# EAGLE design 609_motor (EAGLE 9.2.2)
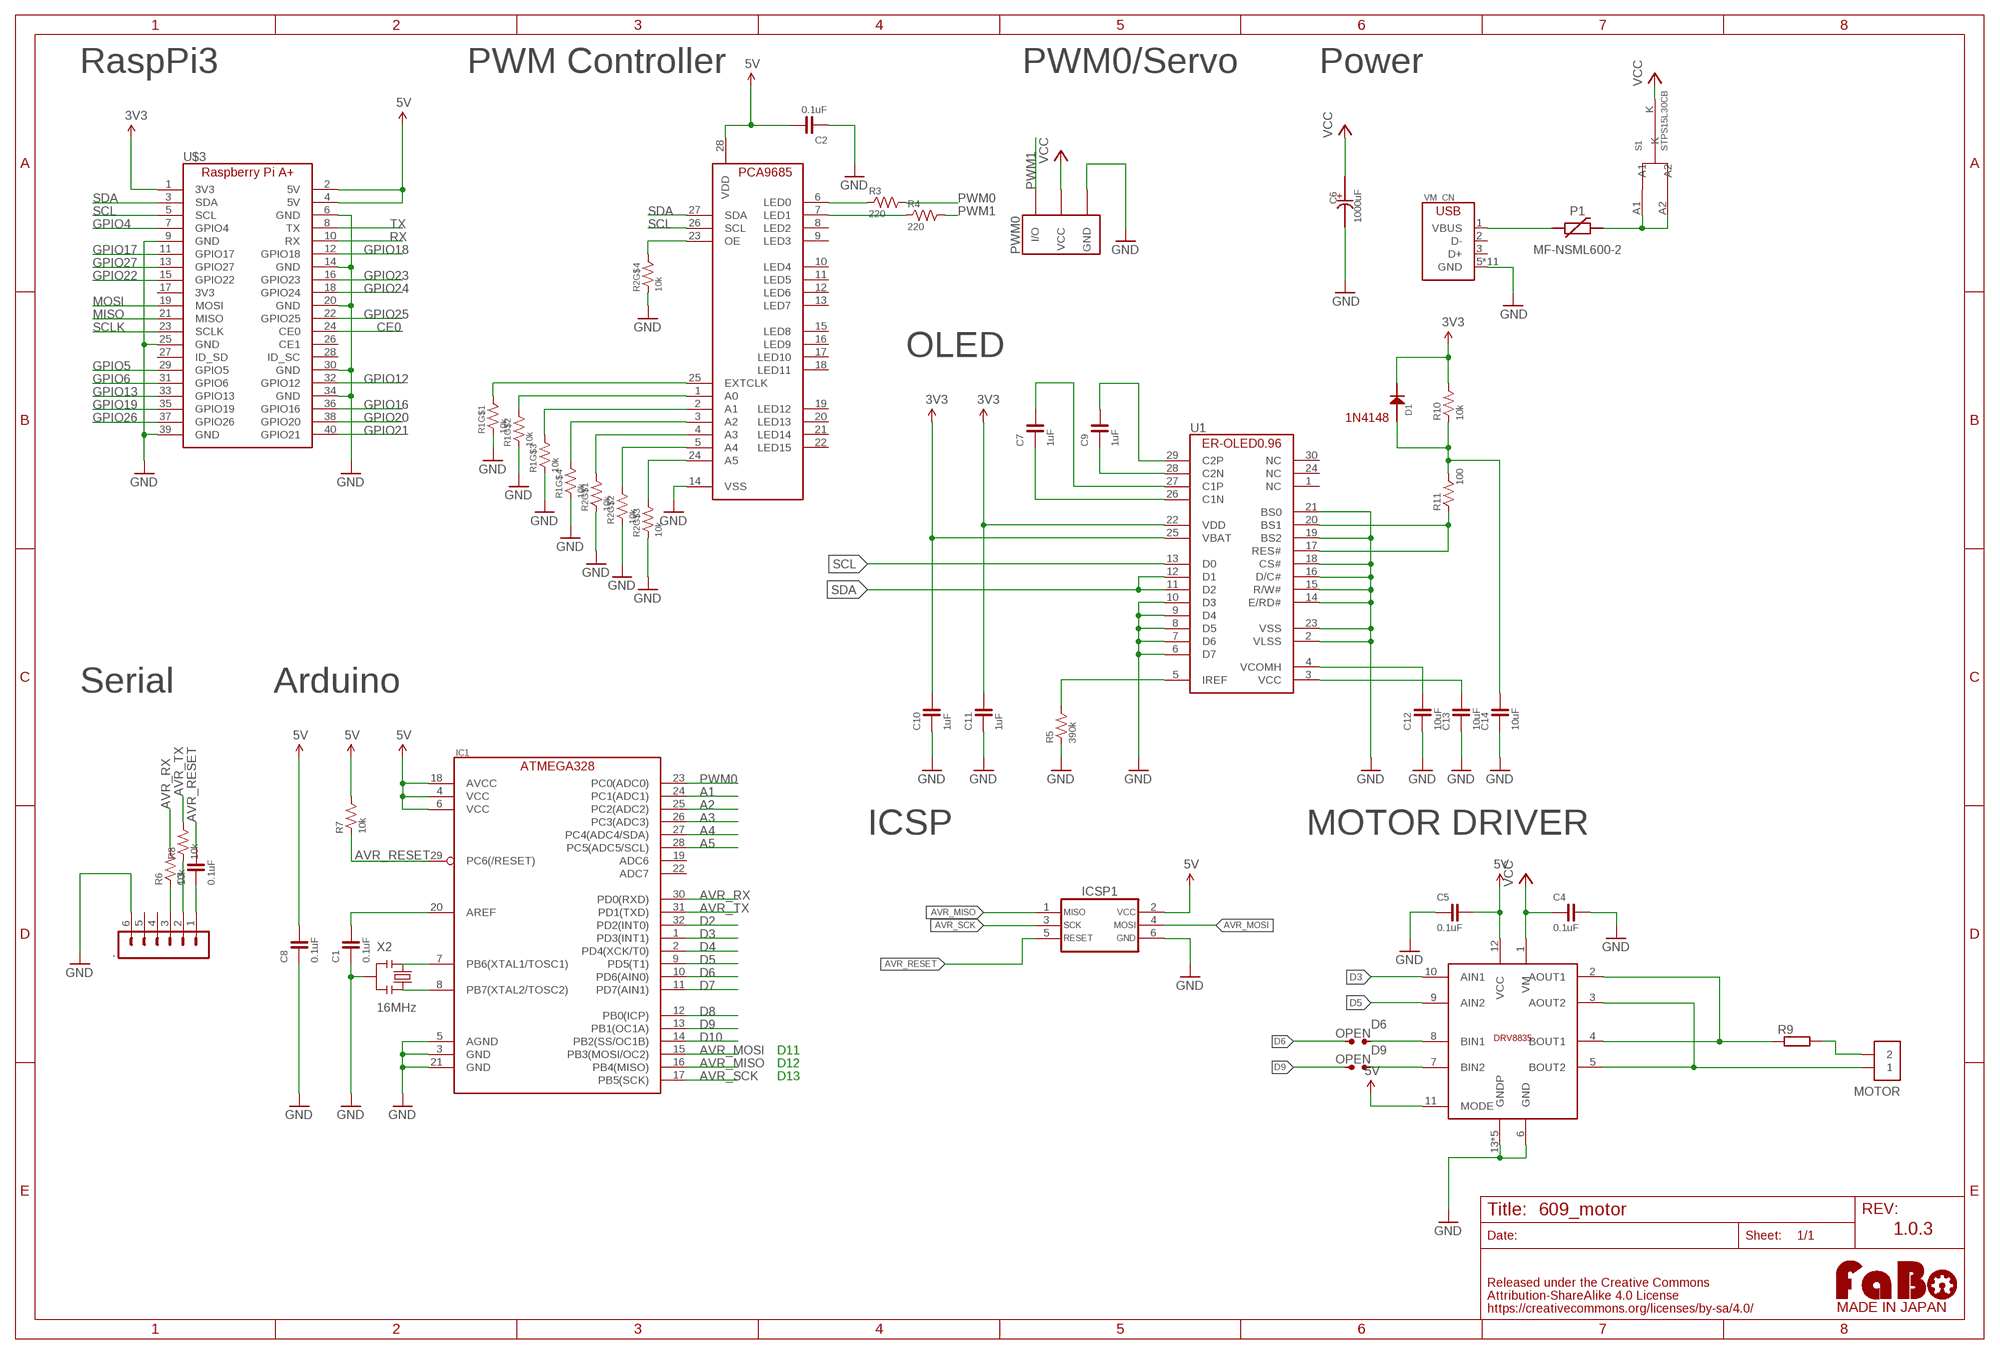
[diagram p0: schematic, sheet 1]

## Parts
.  MA06-1  [MA06-1]
C1  0.1uF  CAPACITOR-0603  [0603]
C2  0.1uF  CAPACITOR-0603  [0603]
C3  0.1uF  CAPACITOR-0603  [0603]
C4  0.1uF  CAPACITOR-0603  [0603]
C5  0.1uF  CAPACITOR-0603  [0603]
C6  1000uF  CAPACITOR-ALUMIN_D12_5  [D12.5]
C7  1uF  CAPACITOR-0603  [0603]
C8  0.1uF  CAPACITOR-0603  [0603]
C9  1uF  CAPACITOR-0603  [0603]
C10  1uF  CAPACITOR-0603  [0603]
C11  1uF  CAPACITOR-0603  [0603]
C12  10uF  CAPACITOR-0603  [0603]
C13  10uF  CAPACITOR-0603  [0603]
C14  10uF  CAPACITOR-0603  [0603]
D1  1N4148  [1N4148W]
D6  OPEN  SMD-JUMPER-2-OPEN  [SMD-JUMPER-2-OPEN]
D9  OPEN  SMD-JUMPER-2-OPEN  [SMD-JUMPER-2-OPEN]
IC1  ATMEGA328P-AU  [TQFP-32]
ICSP1  ICSP_AVR-TC_NOHOLE  [TC2030]
M1  DRV8835  [DRV8835]
MOTOR  PIN_HEADER_1X2WIDE-WIDTH  [PIN_1X2_WIDE_WIDTH]
P1  MF-NSML600-2  POLYSWITCH1206  [1206]
PWM0  FABO_BRICK_3PIN-HEADER  [FABO_BRICK_3PIN_HEADER]
R1  10k  RESISTOR_ARRAY  [EXBV8V]
R2  10k  RESISTOR_ARRAY  [EXBV8V]
R3  220  RESISTOR-0603  [0603]
R4  220  RESISTOR-0603  [0603]
R5  390k  RESISTOR-0603  [0603]
R6  10k  RESISTOR-0603  [0603]
R7  10k  RESISTOR-0603  [0603]
R8  10k  RESISTOR-0603  [0603]
R9  R-EU_0922/22  [0922/22]
R10  10k  RESISTOR-0603  [0603]
R11  100  RESISTOR-0603  [0603]
S1  STPS15L30CB  STPS15L30C  [STPS15L30C]
U1  ER-OLED0.96-1ER-CON30HT-1  [ER-CON30HT-1]
U$3  RASPBERRY_PI_A+  [RASPBERRY_PI_A+]
U$9  PCA9685  [PCA9685]
U$14  LOGO_FABO-M  [LOGO_FABO_MS]
VM_CN  USB-ZX62D  [ZX62D-B-5PA8]
X2  16MHz  RESONATOR  [CSTNE_V_C]

## Nets
3V3: C10.2 C11.2 D1.CATHODE R10.2 U1.22(VDD) U1.25(VBAT) U$3.1(3V3)
5V: C2.2 C5.2 C8.2 IC1.4(VCC) IC1.6(VCC) IC1.18(AVCC) ICSP1.2 M1.11(MODE) M1.12(VCC) R7.2 U$3.2(5V) U$3.4(5V) U$9.28(VDD)
A1: IC1.24(PC1(ADC1))
A2: IC1.25(PC2(ADC2))
A3: IC1.26(PC3(ADC3))
A4: IC1.27(PC4(ADC4/SDA))
A5: IC1.28(PC5(ADC5/SCL))
AVR_MISO: IC1.16(PB4(MISO)) ICSP1.1
AVR_MOSI: IC1.15(PB3(MOSI/OC2)) ICSP1.4
AVR_RESET: C3.2 IC1.29(PC6(/RESET)) ICSP1.5 R7.1
AVR_RX: IC1.30(PD0(RXD)) R6.2
AVR_SCK: IC1.17(PB5(SCK)) ICSP1.3
AVR_TX: IC1.31(PD1(TXD)) R8.2
CE0: U$3.24(CE0)
D2: IC1.32(PD2(INT0))
D3: IC1.1(PD3(INT1)) M1.10(AIN1)
D4: IC1.2(PD4(XCK/T0))
D5: IC1.9(PD5(T1)) M1.9(AIN2)
D6: D6.1 IC1.10(PD6(AIN0))
D7: IC1.11(PD7(AIN1))
D8: IC1.12(PB0(ICP))
D9: D9.1 IC1.13(PB1(OC1A))
D10: IC1.14(PB2(SS/OC1B))
GND: ..6 C1.1 C2.1 C4.2 C5.1 C6.- C8.1 C10.1 C11.1 C12.1 C13.1 C14.1 IC1.3(GND) IC1.5(AGND) IC1.21(GND) ICSP1.6 M1.6(GND) M1.13(GNDP) M1.14(GNDP) M1.15(GNDP) M1.16(GNDP) M1.17(GNDP) PWM0.GND R1.1 R1.2 R1.3 R1.4 R2.1 R2.2 R2.3 R2.4 R5.1 U1.2(VLSS) U1.6(D7) U1.7(D6) U1.8(D5) U1.9(D4) U1.10(D3) U1.14(E/RD#) U1.15(R/W#) U1.16(D/C#) U1.18(CS#) U1.19(BS2) U1.21(BS0) U1.23(VSS) U$3.6(GND) U$3.9(GND) U$3.14(GND) U$3.20(GND) U$3.25(GND) U$3.30(GND) U$3.34(GND) U$3.39(GND) U$9.14(VSS) VM_CN.5(GND) VM_CN.B1(GND) VM_CN.B2(GND) VM_CN.B3(GND) VM_CN.B4(GND) VM_CN.T1(GND) VM_CN.T2(GND) VM_CN.T3(GND) VM_CN.T4(GND) VM_CN.T5(GND) VM_CN.T6(GND) X2.2
GPIO4: U$3.7(GPIO4)
GPIO5: U$3.29(GPIO5)
GPIO6: U$3.31(GPIO6)
GPIO12: U$3.32(GPIO12)
GPIO13: U$3.33(GPIO13)
GPIO16: U$3.36(GPIO16)
GPIO17: U$3.11(GPIO17)
GPIO18: U$3.12(GPIO18)
GPIO19: U$3.35(GPIO19)
GPIO20: U$3.38(GPIO20)
GPIO21: U$3.40(GPIO21)
GPIO22: U$3.15(GPIO22)
GPIO23: U$3.16(GPIO23)
GPIO24: U$3.18(GPIO24)
GPIO25: U$3.22(GPIO25)
GPIO26: U$3.37(GPIO26)
GPIO27: U$3.13(GPIO27)
LED0: R3.1 U$9.6(LED0)
LED1: R4.1 U$9.7(LED1)
MISO: U$3.21(MISO)
MOSI: U$3.19(MOSI)
N$2: C7.2 U1.27(C1P)
N$3: D6.2 M1.8(BIN1)
N$4: ..3 R6.1
N$5: IC1.8(PB7(XTAL2/TOSC2)) X2.3
N$6: ..2 R8.1
N$7: R2.5 U$9.23(OE)
N$8: R1.8 U$9.25(EXTCLK)
N$9: R1.7 U$9.1(A0)
N$10: R1.6 U$9.2(A1)
N$11: R1.5 U$9.3(A2)
N$12: R2.8 U$9.4(A3)
N$13: R2.7 U$9.5(A4)
N$14: R2.6 U$9.24(A5)
N$15: IC1.7(PB6(XTAL1/TOSC1)) X2.1
N$16: C1.2 IC1.20(AREF)
N$17: ..1 C3.1
N$18: D9.2 M1.7(BIN2)
N$19: MOTOR.2 R9.2
N$20: C7.1 U1.26(C1N)
N$21: M1.2(AOUT1) M1.4(BOUT1) R9.1
N$22: M1.3(AOUT2) M1.5(BOUT2) MOTOR.1
N$23: C9.1 U1.28(C2N)
N$24: C9.2 U1.29(C2P)
N$25: R5.2 U1.5(IREF)
N$26: C12.2 U1.4(VCOMH)
N$27: C13.2 U1.3(VCC)
N$28: R11.1 U1.17(RES#) U1.20(BS1)
N$29: C14.2 D1.ANODE R10.1 R11.2
PTCP1: P1.P$1 VM_CN.1(VBUS)
PTCP2: P1.P$2 S1.A1 S1.A2
PWM0: IC1.23(PC0(ADC0)) R3.2
PWM1: PWM0.I/O R4.2
RX: U$3.10(RX)
SCL: U1.13(D0) U$3.5(SCL) U$9.26(SCL)
SCLK: U$3.23(SCLK)
SDA: U1.11(D2) U1.12(D1) U$3.3(SDA) U$9.27(SDA)
TX: U$3.8(TX)
VCC: C4.1 C6.+ M1.1(VM) PWM0.VCC S1.K
Unconnected: ..4 ..5 IC1.19(ADC6) IC1.22(ADC7) U1.1(NC) U1.24(NC) U1.30(NC) U$3.17(3V3) U$3.26(CE1) U$3.27(ID_SD) U$3.28(ID_SC) U$9.8(LED2) U$9.9(LED3) U$9.10(LED4) U$9.11(LED5) U$9.12(LED6) U$9.13(LED7) U$9.15(LED8) U$9.16(LED9) U$9.17(LED10) U$9.18(LED11) U$9.19(LED12) U$9.20(LED13) U$9.21(LED14) U$9.22(LED15) VM_CN.2(D-) VM_CN.3(D+)

## Notes on the sheet
- RaspPi3 | PWM Controller | PWM0/Servo | Power
- OLED
- 1N4148
- Serial | Arduino
- ICSP | MOTOR DRIVER
- D11
- D12
- D13
- 1.0.3

## Library data of the parts
. = con-lstb:MA06-1: PIN HEADER; OC_FARNELL: unknown; OC_NEWARK: unknown
C1-C5 C7-C14 = FaBo-Capacitor:CAPACITOR: CAPACITOR
C6 = FaBo-Capacitor:CAPACITOR-ALUMIN
D1 = FaBo-Diode:1N4148
D6 D9 = FaBo-Supply:SMD-JUMPER-2
IC1 = component:ATMEGA328
ICSP1 = component:ICSP_AVR
M1 = FaBo-Motor:DRV8835
MOTOR = FaBo-PIN:PIN_HEADER_1X2
P1 = FaBo-Supply:POLYSWITCH
PWM0 = FaBo-Template:FABO_BRICK_3PIN: FaBo Brick 3pin
R1 R2 = component:RESISTOR_ARRAY
R3-R8 R10 R11 = FaBo-Resistors:RESISTOR: RESISTOR
R9 = resistor:R-EU_: RESISTOR, European symbol
S1 = FaBo-Supply:STPS15L30C
U1 = FaBo-Display:ER-OLED0.96-1
U$3 = FaBo-Boards:RASPBERRY_PI_A+
U$9 = FaBo-Motor:PCA9685
U$14 = FaBo-etc:LOGO_FABO
VM_CN = component:USB
X2 = component:RESONATOR

## Board
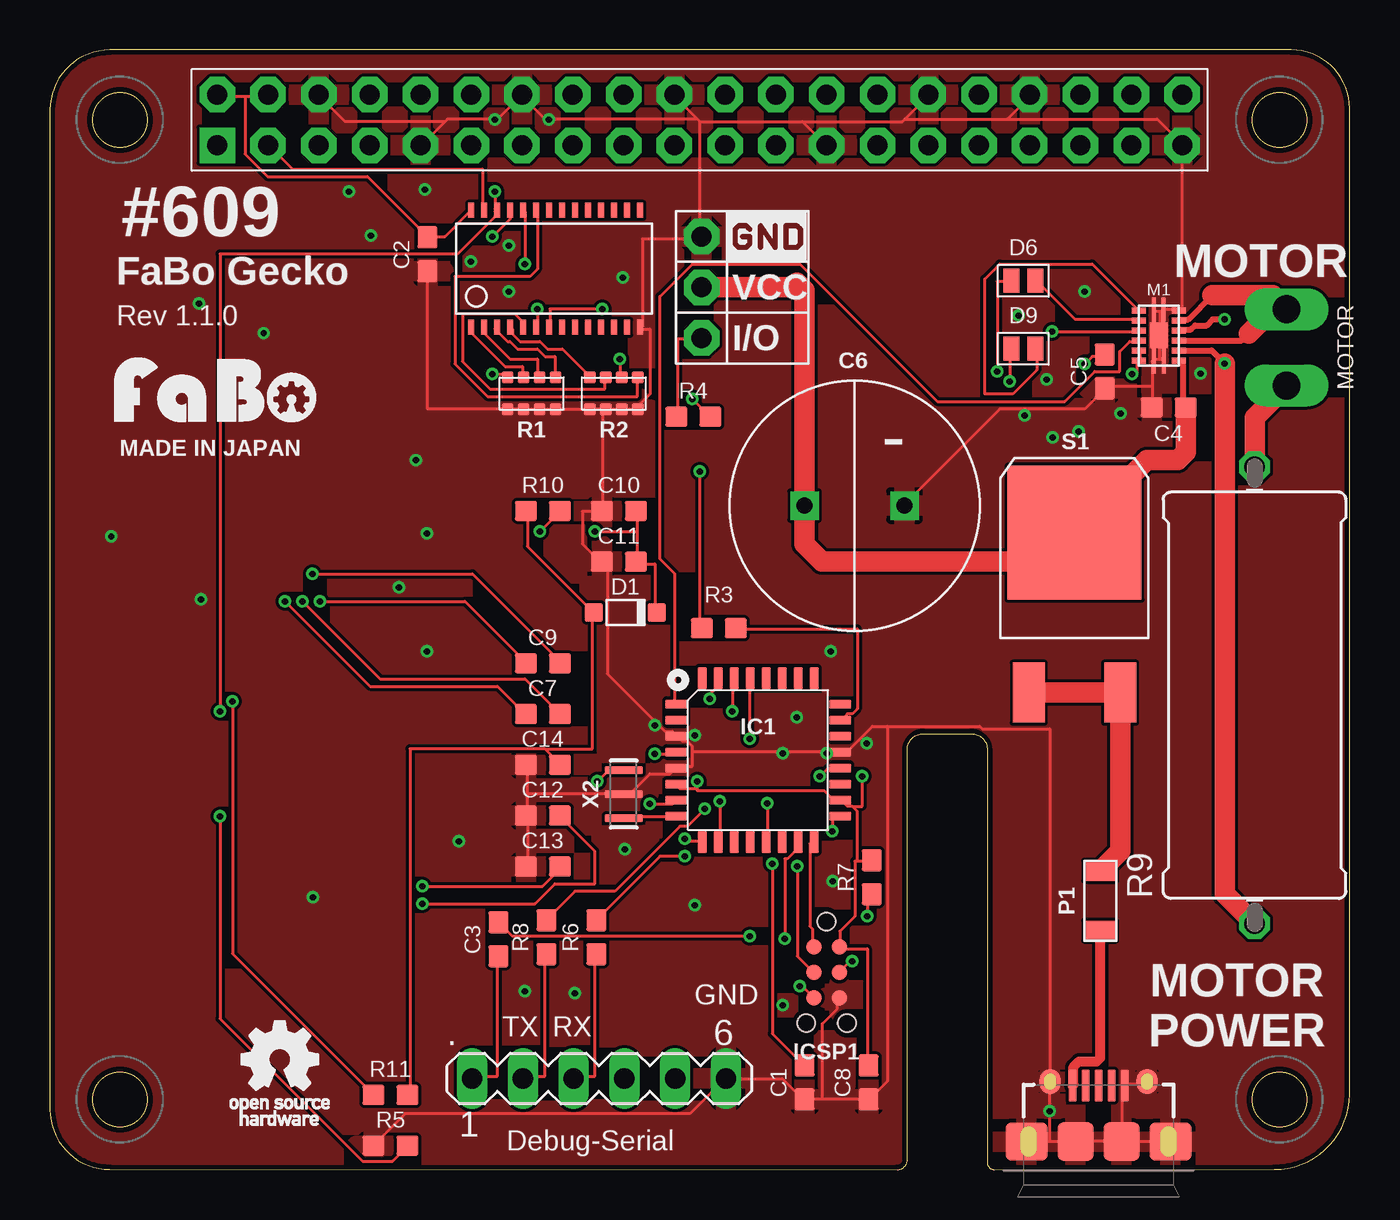
[diagram p1: board, top side]
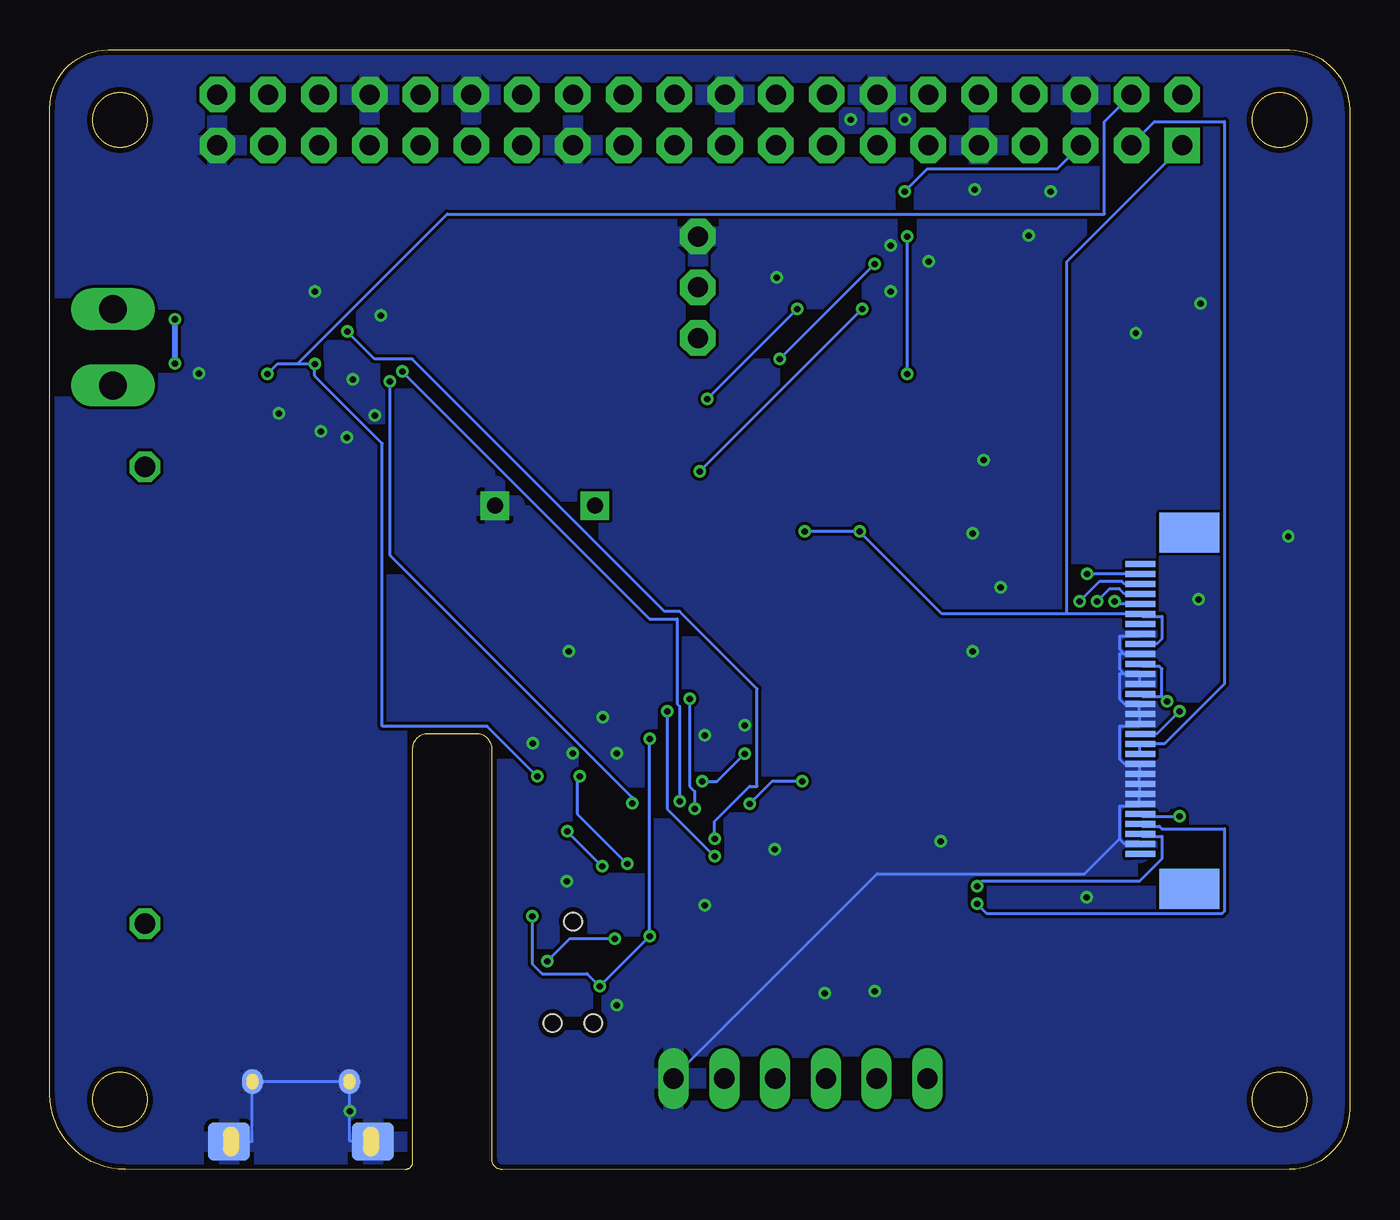
[diagram p2: board, bottom side, seen from below]

Size 65 x 56 mm. Coordinates in mm from the lower left corner, seen from the top.
Copper layers (1*16): Top 0.035mm / dielectric 1.6mm / Bottom 0.035mm
Design rules "PCBway": minimum track width 6mil, minimum drill 12mil, track to track 6mil, track to pad 6mil, pad to pad 6mil, via to via 6mil, smd to smd 6mil, copper to edge 10mil, drill to drill 10mil, minimum pad ring 10mil, minimum via ring 6mil, stop-mask expansion 2mil, vias tented up to drill 100mil, thermal gap 8mil

### Footprints (pad centres in the part's own frame; a part is rotated, then mirrored left to right if it is on the bottom)
MA06-1 = drill 1.016 long: 1 -6.35,0; 2 -3.81,0; 3 -1.27,0; 4 1.27,0; 5 3.81,0; 6 6.35,0
0603 = smd 1.1 x 1: 1 -0.85,0; 2 0.85,0
D12.5 = drill 0.8 pad 1.422 square: + -2.472,0.254; - 2.528,0.254
1N4148W = smd 0.9 x 0.95: ANODE 0,0; CATHODE 3.15,0
SMD-JUMPER-2-OPEN = smd 0.8 x 1.2: 1 -0.6,0; 2 0.6,0
TQFP-32 = smd 1.1 x 0.45: 1 -4.1,2.8; 2 -4.1,2; 3 -4.1,1.2; 4 -4.1,0.4; 5 -4.1,-0.4; 6 -4.1,-1.2; 7 -4.1,-2; 8 -4.1,-2.8; 17 4.1,-2.8; 18 4.1,-2; 19 4.1,-1.2; 20 4.1,-0.4; 21 4.1,0.4; 22 4.1,1.2; 23 4.1,2; 24 4.1,2.8 | smd 0.45 x 1.1: 9 -2.8,-4.1; 10 -2,-4.1; 11 -1.2,-4.1; 12 -0.4,-4.1; 13 0.4,-4.1; 14 1.2,-4.1; 15 2,-4.1; 16 2.8,-4.1; 25 2.8,4.1; 26 2,4.1; 27 1.2,4.1; 28 0.4,4.1; 29 -0.4,4.1; 30 -1.2,4.1; 31 -2,4.1; 32 -2.8,4.1
TC2030 = smd 0.787 x 0.787: 1 1.27,-0.635; 2 1.27,0.635; 3 2.54,-0.635; 4 2.54,0.635; 5 3.81,-0.635; 6 3.81,0.635 | hole 0.889: 0,0; 5.08,-1.016; 5.08,1.016
DRV8835 = smd 0.3 x 0.7: 1 -1.25,-1; 2 -0.75,-1; 3 -0.25,-1; 4 0.25,-1; 5 0.75,-1; 6 1.25,-1; 7 1.25,1; 8 0.75,1; 9 0.25,1; 10 -0.25,1; 11 -0.75,1; 12 -1.25,1 | smd 1.27 x 0.9: 13 0,0 | smd 1.3 x 0.2: 14 -1.25,-0.25; 15 -1.25,0.25; 16 1.25,0.237; 17 1.25,-0.245
PIN_1X2_WIDE_WIDTH = drill 1.397 long: 1 -1.905,0; 2 1.905,0
1206 = smd 1 x 1.6: P$1 -1.5,0; P$2 1.5,0
FABO_BRICK_3PIN_HEADER = drill 1 pad 1.778 octagon: GND -2.54,0; I/O 2.54,0; VCC 0,0
EXBV8V = smd 0.6 x 0.6: 1 -1.2,-0.8; 2 -0.4,-0.8; 3 0.4,-0.8; 4 1.2,-0.8; 5 1.2,0.8; 6 0.4,0.8; 7 -0.4,0.8; 8 -1.2,0.8
0922/22 = drill 1.016 octagon: 1 -11.43,0; 2 11.43,0
STPS15L30C = smd 1.6 x 3: A1 -2.286,-6.13; A2 2.286,-6.13 | smd 6.7 x 6.7: K 0,1.87
ER-CON30HT-1 = smd 0.3 x 1.5 bottom: 1 7,-0.23; 2 6.5,-0.23; 3 6,-0.23; 4 5.5,-0.23; 5 5,-0.23; 6 4.5,-0.23; 7 4,-0.23; 8 3.5,-0.23; 9 3,-0.23; 10 2.5,-0.23; 11 2,-0.23; 12 1.5,-0.23; 13 1,-0.23; 14 0.5,-0.23; 15 0,-0.23; 16 -0.5,-0.23; 17 -1,-0.23; 18 -1.5,-0.23; 19 -2,-0.23; 20 -2.5,-0.23; 21 -3,-0.23; 22 -3.5,-0.23; 23 -4,-0.23; 24 -4.5,-0.23; 25 -5,-0.23; 26 -5.5,-0.23; 27 -6,-0.23; 28 -6.5,-0.23; 29 -7,-0.23; 30 -7.5,-0.23 | smd 2 x 3 bottom: 31 -9.07,-2.67; 32 8.74,-2.67
RASPBERRY_PI_A+ = drill 1 pad 1.778 square: 1 8.484,51.435 | drill 1 pad 1.778 octagon: 2 8.484,53.975; 3 11.024,51.435; 4 11.024,53.975; 5 13.564,51.435; 6 13.564,53.975; 7 16.104,51.435; 8 16.104,53.975; 9 18.644,51.435; 10 18.644,53.975; 11 21.184,51.435; 12 21.184,53.975; 13 23.724,51.435; 14 23.724,53.975; 15 26.264,51.435; 16 26.264,53.975; 17 28.804,51.435; 18 28.804,53.975; 19 31.344,51.435; 20 31.344,53.975; 21 33.884,51.435; 22 33.884,53.975; 23 36.424,51.435; 24 36.424,53.975; 25 38.964,51.435; 26 38.964,53.975; 27 41.504,51.435; 28 41.504,53.975; 29 44.044,51.435; 30 44.044,53.975; 31 46.584,51.435; 32 46.584,53.975; 33 49.124,51.435; 34 49.124,53.975; 35 51.664,51.435; 36 51.664,53.975; 37 54.204,51.435; 38 54.204,53.975; 39 56.744,51.435; 40 56.744,53.975
PCA9685 = smd 0.3 x 0.75: 1 -4.15,-2.93; 2 -3.5,-2.93; 3 -2.85,-2.93; 4 -2.2,-2.93; 5 -1.55,-2.93; 6 -0.9,-2.93; 7 -0.25,-2.93; 8 0.4,-2.93; 9 1.05,-2.93; 10 1.7,-2.93; 11 2.35,-2.93; 12 3,-2.93; 13 3.65,-2.93; 14 4.3,-2.93; 15 4.3,2.92; 16 3.65,2.92; 17 3,2.92; 18 2.35,2.92; 19 1.7,2.92; 20 1.05,2.92; 21 0.4,2.92; 22 -0.25,2.92; 23 -0.9,2.92; 24 -1.55,2.92; 25 -2.2,2.92; 26 -2.85,2.92; 27 -3.5,2.92; 28 -4.15,2.92
ZX62D-B-5PA8 = smd 0.4 x 1.6: 1 -1.3,4.25; 2 -0.65,4.25; 3 0,4.25; 4 0.65,4.25; 5 1.3,4.25 | smd 1.05 x 1.25 bottom: B1 -2.425,4.45; B2 2.425,4.45 | smd 2.1 x 1.9 bottom: B3 -3.6,1.45; B4 3.6,1.45 | smd 1.05 x 1.25: T1 -2.425,4.45; T2 2.425,4.45 | smd 2.1 x 1.9: T3 -3.6,1.45; T6 3.6,1.45 | smd 1.8 x 1.9: T4 -1.15,1.45; T5 1.15,1.45
CSTNE_V_C = smd 0.4 x 1.9: 1 1.2,0; 2 0,0; 3 -1.2,0

### Placement (x,y rotation side)
.  27.46,4.56 0 top
C1  37.74,4.37 90 top
C2  18.88,45.78 90 top
C3  22.43,11.53 90 top
C4  55.95,38.13 180 top
C5  52.75,39.93 90 top
C6  40.21,32.95 0 top
C7  24.65,22.79 0 top
C8  40.94,4.37 90 top
C9  24.65,25.33 0 top
C10  28.46,32.95 0 top
C11  28.46,30.41 0 top
C12  24.65,17.71 0 top
C13  24.65,15.17 0 top
C14  24.65,20.25 0 top
D1  27.19,27.87 0 top
D6  48.69,44.46 0 top
D9  48.69,41.06 0 top
IC1  35.42,20.49 0 top
ICSP1  38.84,12.41 270 top
M1  55.45,41.73 90 top
MOTOR  61.85,41.13 270 top
P1  52.53,13.45 90 top
PWM0  32.59,44.14 270 top
R1  24.09,38.82 0 top
R2  28.21,38.82 0 top
R3  33.46,27.08 0 top
R4  32.18,37.67 180 top
R5  17.03,1.2 0 top
R6  27.33,11.63 90 top
R7  41.1,14.63 90 top
R8  24.83,11.63 90 top
R9  60.25,23.73 90 top
R10  24.65,32.95 0 top
R11  17.03,3.74 0 top
S1  51.24,30 0 top
U1  10.68,22.79 270 top
U$3  -0.11,-0.2 0 top
U$4  [LOGO_OSHW_T_MS]  11.51,5.48 0 top
U$7  [LOGO_SILK_GND]  33.99,45.41 0 top
U$9  25.22,45.07 0 top
U$14  8.27,37.01 0 top
VM_CN  52.45,-0.05 0 top
X2  28.69,18.79 90 top

### Tracks (layer width: path | path; a pad name or v marks a point on that pad's centre or on a via)
3V3  (via drill 0.3)
  Top 0.152: D1.CATHODE 30.25,27.93 30.25,30.3 29.38,30.3 C11.2 29.38,30.43 29.38,31.93 | 29.38,31.93 29.38,32.93 C10.2 | v24.5,31.93 25.5,32.93 R10.2 | v27.25,31.93 29.38,31.93
  Bottom 0.152: 14.13,27.8 10.5,27.8 U1.25 10.38,27.68 9.38,27.68 9.38,26.55 9.63,26.3 10.38,26.3 U1.22 | 14.13,27.8 20.38,27.8 v24.5,31.93 v27.25,31.93 | 14.13,27.8 14.13,45.43 8.38,51.18 U$3.1
5V  (via drill 0.3)
  Top 0.152: U$9.28 19.75,46.68 18.88,46.68 | 18.88,46.68 15.88,49.68 10.88,49.68 9.75,50.8 9.75,53.68 | 9.75,53.68 10.88,53.68 U$3.4 | 18.88,46.68 C2.2 | 9.75,53.68 8.38,53.68 U$3.2 | M1.11 54.5,40.93 54.5,40.55 M1.12 54.38,40.43 54.38,39.8 v54.13,39.8 | v51.75,40.3 52.13,40.68 52.75,40.68 C5.2 | 40.38,15.43 41,15.43 R7.2 | 40.38,15.43 40.25,15.43 40.25,12.68 39.5,11.93 39.5,11.18 ICSP1.2 39.5,11.05 40.88,11.05 40.88,5.3 C8.2 | 40.13,18.18 39.88,18.18 39.63,18.43 IC1.18 39.5,18.55 39.13,18.55 38.73,18.95 32.38,18.95 32.38,19.05 | 40.13,18.18 40.38,17.93 40.38,15.43 | 32.38,19.05 31.5,19.05 31.38,19.18 IC1.6 | v30.25,20.8 31.25,20.8 IC1.4 | 32.38,19.05 v32.38,19.43 | v40.63,19.68 40.63,18.18 40.13,18.18
  Bottom 0.152: v54.13,39.8 53.63,40.3 52.63,40.3 | 52.63,40.3 v51.75,40.3 51.75,39.7 48.38,36.33 48.38,22.18 43.13,22.18 v40.63,19.68 | v30.25,20.8 31.63,19.43 v32.38,19.43 | 52.63,40.3 45.13,47.8 12.25,47.8 12.25,52.43 11,53.68 U$3.4
AVR_MISO
  Top 0.152: ICSP1.1 38.13,11.18 38.13,12.05 38,12.18 38,16.3 38.13,16.3 IC1.16
AVR_MOSI  (via drill 0.3)
  Top 0.152: v40.13,10.43 40,10.43 39.5,9.93 ICSP1.4 | v36.75,11.55 36.75,15.55 36.88,15.55 37.38,16.05 37.38,16.3 IC1.15
  Bottom 0.152: v40.13,10.43 39,11.55 v36.75,11.55
AVR_RESET  (via drill 0.3)
  Top 0.152: ICSP1.5 37.63,9.18 v37.5,9.18 | v40.88,12.68 40.88,13.68 41,13.68 R7.1 | v35,11.68 23.13,11.68 22.5,12.3 C3.2 | v35,21.55 35,24.55 IC1.29
  Bottom 0.152: v40.88,12.68 40.88,10.3 40.38,9.8 38.13,9.8 v37.5,9.18 v35,11.68 v35,21.55
AVR_RX  (via drill 0.3)
  Top 0.152: v31.75,15.68 30.5,15.68 27.38,12.55 R6.2 | v34.13,22.93 34.13,24.55 IC1.30
  Bottom 0.152: v31.75,15.68 34.13,18.05 v34.13,22.93
AVR_SCK  (via drill 0.3)
  Top 0.152: v37.38,15.18 37.38,10.68 38.13,9.93 ICSP1.3 | v39.13,16.93 39.13,17.68 39.5,17.68 IC1.17
  Bottom 0.152: v39.13,16.93 v37.38,15.18
AVR_TX  (via drill 0.3)
  Top 0.152: v32.75,18.05 31.88,17.18 31.5,17.18 28.25,13.93 26.25,13.93 24.88,12.55 R8.2 | v33,23.55 33,23.8 33.38,24.18 33.38,24.55 IC1.31
  Bottom 0.152: v32.75,18.05 32.75,18.93 33,19.18 v33,23.55
D3
  Top 0.152: M1.10 54.38,41.43 54,41.43 53.5,40.93 53.5,39.93 52.25,39.93 50.75,38.43 44.38,38.43 37.5,45.3 32.13,45.3 30.5,43.68 30.5,30.55 31.25,29.8 31.25,23.3 IC1.1
D5  (via drill 0.3)
  Top 0.152: v50.13,41.93 54.38,41.93 M1.9 | v31.75,16.55 31.88,16.43 32.5,16.43 IC1.9
  Bottom 0.152: v50.13,41.93 48.75,40.55 46.88,40.55 34.25,27.93 33.5,27.93 29.63,24.05 29.63,19.18 30,19.18 31.75,17.43 v31.75,16.55
D6  (via drill 0.3)
  Top 0.152: v33.5,18.43 33.5,16.43 IC1.10 | v47.38,39.93 47.38,44.43 48,44.43 D6.1
  Bottom 0.152: v33.5,18.43 33.5,23.18 33.63,23.3 33.63,27.55 35,27.55 v47.38,39.93
D9  (via drill 0.3)
  Top 0.152: v35.88,18.33 35.88,16.43 IC1.13 | v48,39.43 48,41.05 D9.1
  Bottom 0.152: v35.88,18.33 35.88,18.63 48,30.75 v48,39.43
GND  (via drill 0.3)
  Top 0.152: 38.63,3.55 38.63,7.3 39.38,8.05 39.38,8.55 ICSP1.6 | 38.63,3.55 37.75,3.55 C1.1 37.63,3.55 36.63,4.55 33.88,4.55 ..6 33.75,4.55 32,2.8 17.75,2.8 16.25,1.3 R5.1 | 38.63,3.55 40.88,3.55 C8.1 41,3.55 41.88,4.43 41.88,22.18 | 50,1.43 v50,2.93 50,4.3 VM_CN.T1 50,4.43 50,22.05 46.63,22.05 46.5,22.18 41.88,22.18 | 50,1.43 48.88,1.43 VM_CN.T3 | 50,1.43 51.25,1.43 VM_CN.T4 51.38,1.43 53.5,1.43 VM_CN.T5 53.63,1.43 | VM_CN.T2 54.75,4.3 53.75,4.3 VM_CN.5 53.63,4.18 53.63,1.43 | 53.63,1.43 56,1.43 VM_CN.B4 | C13.1 23.88,15.18 23.88,17.68 C12.1 23.88,17.8 23.88,18.8 | 23.88,18.8 23.88,20.18 C14.1 | 32.13,20.93 32.13,20.18 31.38,20.18 IC1.5 31.25,20.05 31,19.8 30,19.8 29,18.8 28.75,18.8 X2.2 28.63,18.8 23.88,18.8 | 32.13,20.93 32.13,21.18 31.88,21.43 31.63,21.43 31.38,21.68 IC1.3 31.25,21.8 31.13,21.93 30.75,21.93 27.88,24.8 27.88,30.3 27.63,30.3 C11.1 27.5,30.43 26.63,31.3 26.63,32.93 27.5,32.93 C10.1 27.63,33.05 27.63,38.05 | 32.13,20.93 39.5,20.93 IC1.21 39.63,20.93 39.88,20.93 41.13,22.18 41.88,22.18 | 55.5,42.93 55.5,41.8 M1.13 55.5,41.68 55.5,40.55 | 55.5,42.93 55.63,42.93 M1.17 55.75,43.05 56.38,43.05 M1.6 56.5,43.05 56.63,43.05 56.63,51.18 U$3.39 56.63,51.3 55.38,52.55 47.88,52.55 | 55.5,42.93 55.25,42.93 M1.16 | 55.13,39.18 55.13,40.43 M1.15 55.25,40.55 55.5,40.55 | 55.13,39.18 55.13,38.18 C4.2 | 55.13,39.18 52.75,39.18 C5.1 52.75,39.05 51.75,38.05 47.5,38.05 42.75,33.3 C6.- | 55.5,40.55 55.63,40.55 M1.14 | 27.63,38.05 27.75,38.05 R2.2 | 27.63,38.05 27.13,38.05 R2.1 27,38.05 25.38,38.05 R1.4 25.25,38.05 24.5,38.05 R1.3 24.38,38.05 23.75,38.05 R1.2 23.63,38.05 23,38.05 R1.1 22.88,38.05 18.88,38.05 C2.1
  Top 0.152: R2.2 27.88,38.05 28.5,38.05 R2.3 28.63,38.05 29.38,38.05 R2.4 29.5,38.05 29.5,38.3 30,38.8 30,42.05 29.63,42.05 U$9.14 29.63,42.18 29.63,46.55 32.5,46.55 PWM0.GND 32.5,46.68 32.5,52.43 | 27.63,38.05 R2.2 | 19.75,52.43 19.88,52.55 22.38,52.55 23.5,53.68 U$3.14 23.63,53.68 24.75,52.55 32.38,52.55 | 19.75,52.43 18.63,51.3 U$3.9 | 19.75,52.43 14.75,52.43 13.5,53.68 U$3.6 | 32.5,52.43 32.38,52.55 | 32.38,52.55 31.25,53.68 U$3.20 | 37.63,52.43 38.75,51.3 U$3.25 | 32.5,52.43 37.63,52.43 | 42.75,52.55 42.63,52.43 37.63,52.43 | 42.75,52.55 43.88,53.68 U$3.30 | 47.88,52.55 49,53.68 U$3.34 | 42.75,52.55 47.88,52.55
  Bottom 0.152: 11.5,16.55 11.25,16.3 10.5,16.3 U1.2 | 11.5,16.55 11.5,18.18 10.5,18.18 U1.6 10.5,18.3 10.5,18.68 U1.7 10.5,18.8 10.5,19.18 U1.8 10.5,19.3 10.5,19.68 U1.9 10.5,19.8 10.5,20.18 U1.10 10.5,20.3 11.25,20.3 11.5,20.55 11.5,22.18 10.5,22.18 U1.14 10.5,22.3 10.5,22.68 U1.15 10.5,22.8 10.5,23.18 U1.16 10.5,23.3 11.25,23.3 11.5,23.55 11.5,24.8 11.25,24.8 | U1.18 10.5,24.3 10.5,24.68 U1.19 10.5,24.8 11.25,24.8 | 11.25,25.8 10.5,25.8 U1.21 | 11.25,25.8 11.5,26.05 11.5,26.68 10.5,26.68 U1.23 | 11.25,24.8 11.5,25.05 11.5,25.8 11.25,25.8 | 11.5,16.55 13.25,14.8 23.63,14.8 33.75,4.68 ..6 | VM_CN.T3 48.88,1.43 50,1.43 v50,2.93 50,4.3 VM_CN.T1 50.13,4.43 54.75,4.43 VM_CN.T2 54.88,4.3 54.88,1.43 56,1.43 VM_CN.B4
  other vias: 18.3,35.49 3.06,31.68 10.68,41.84 32.25,13.23 28.75,16.03 20.45,16.43 23.75,8.93 26.25,8.83 37.35,22.63 39.05,25.93 18.85,25.93 7.55,28.53 7.45,43.33 18.75,49.03 14.95,48.93 16.05,46.73 22.95,43.93 28.65,44.63 32.25,21.73 36.65,8.23 39.15,14.43 51.75,43.93 57.55,39.83 48.45,42.73 24.95,52.53 22.25,52.53 21.05,45.43 22.95,46.23 51.45,36.93 53.55,37.83 49.85,39.53 50.15,36.63 48.75,37.73 30.25,22.23 40.85,21.33 38.85,20.83 36.65,20.83 13.15,13.63 18.85,31.83 17.45,29.13
  pour Bottom: -0.75,-0.07 65.29,-0.07 65.29,55.81 -0.75,55.81
  pour Top: -0.75,-0.07 65.29,-0.07 65.29,55.81 -0.75,55.81
LED0  (via drill 0.3)
  Top 0.152: v24.38,43.05 24.38,42.18 U$9.6 | v32.5,34.93 32.5,27.18 R3.1
  Bottom 0.152: v32.5,34.93 v24.38,43.05
LED1  (via drill 0.3)
  Top 0.152: v27.63,43.05 25,43.05 25,42.18 U$9.7 | v32.13,38.55 33,37.68 R4.1
  Bottom 0.152: v32.13,38.55 v27.63,43.05
N$2  (via drill 0.3)
  Top 0.152: v12.63,28.43 16.5,24.55 23.75,24.55 25.5,22.8 C7.2
  Bottom 0.152: v12.63,28.43 12,29.05 11.5,29.05 11.25,28.8 10.5,28.8 U1.27
N$3
  Top 0.152: M1.8 54.38,42.55 51.25,42.55 49.38,44.43 D6.2
N$4
  Top 0.152: R6.1 27.25,10.68 27.25,4.68 26.25,4.68 ..3
N$5
  Top 0.152: IC1.8 31.25,17.68 28.75,17.68 X2.3
N$6
  Top 0.152: R8.1 24.75,10.68 24.75,4.68 23.75,4.68 ..2
N$7
  Top 0.152: R2.5 29.38,39.55 29.38,38.68 21.88,38.68 20.25,40.3 20.25,44.68 24,44.68 24.38,45.05 24.38,47.93 U$9.23
N$8  (via drill 0.3)
  Top 0.152: v22.13,39.8 22.75,39.8 22.88,39.68 R1.8 | v22.13,46.68 23,47.55 23,47.93 U$9.25
  Bottom 0.152: v22.13,46.68 v22.13,39.8
N$9
  Top 0.152: R1.7 23.63,39.68 23.63,40.18 22.75,40.18 21.13,41.8 21.13,42.05 U$9.1
N$10
  Top 0.152: R1.6 24.38,39.68 24.38,40.55 23,40.55 21.75,41.8 21.75,42.05 U$9.2
N$11
  Top 0.152: R1.5 25.25,39.68 25.25,40.68 24.75,40.68 24.38,41.05 23.38,41.05 23,41.43 22.88,41.43 22.25,42.05 U$9.3
N$12
  Top 0.152: R2.8 27,39.68 25.63,41.05 24.88,41.05 24.5,41.43 23.5,41.43 23.13,41.8 23.13,42.05 U$9.4
N$13
  Top 0.152: R2.7 27.75,39.55 27.75,39.05 22,39.05 20.63,40.43 20.63,42.8 23.25,42.8 23.63,42.43 23.63,42.18 U$9.5
N$14  (via drill 0.3)
  Top 0.152: v28.5,40.55 28.5,39.68 R2.6 | v23.75,45.3 23.75,47.93 U$9.24
  Bottom 0.152: v23.75,45.3 v28.5,40.55
N$15  (via drill 0.3)
  Top 0.152: v30,18.3 31.13,18.3 31.25,18.43 IC1.7 | v27.38,19.43 27.88,19.93 28.63,19.93 X2.1
  Bottom 0.152: v30,18.3 28.88,19.43 v27.38,19.43
N$16  (via drill 0.3)
  Top 0.152: v36.13,15.3 36.13,6.8 37.63,5.3 C1.2 | v38.5,19.68 38.88,20.05 39.5,20.05 IC1.20
  Bottom 0.152: v36.13,15.3 38.63,17.8 38.63,19.68 v38.5,19.68
N$17
  Top 0.152: C3.1 22.38,10.68 22.38,4.68 21.13,4.68 ..1
N$18
  Top 0.152: M1.7 52.13,45.3 47.5,45.3 46.75,44.55 46.75,38.8 48.15,38.8 49.35,40 49.35,41 D9.2
N$19
  Top 1.016: R9.2 60.25,37.62 MOTOR.2
N$20  (via drill 0.3)
  Top 0.152: v11.75,28.43 16,24.18 22.38,24.18 23.75,22.8 C7.1
  Bottom 0.152: v11.75,28.43 11.63,28.3 10.5,28.3 U1.26
N$21  (via drill 0.3)
  Top 0.3: M1.4 56.5,42.02 57.07,42.02 57.28,42.23 57.85,42.23 58.16,42.53 v58.75,42.53 | M1.2 58.1,40.98 v58.75,40.33
  Top 1.016: v58.75,40.33 58.75,13.8 R9.1
  Bottom 0.3: v58.75,42.53 v58.75,40.33
N$22
  Top 0.3: M1.3 59.6,41.48 59.95,41.83
  Top 0.305: M1.5 56.5,42.52 56.93,42.52 58.14,43.73
  Top 1.016: 59.95,41.83 61.16,43.03 MOTOR.1 61.15,43.73 58.14,43.73
N$23  (via drill 0.3)
  Top 0.152: v13.5,28.43 20.75,28.43 23.75,25.43 C9.1
  Bottom 0.152: v13.5,28.43 12.5,29.43 11.38,29.43 11.25,29.3 10.5,29.3 U1.28
N$24  (via drill 0.3)
  Top 0.152: v13.13,29.8 21.13,29.8 25.5,25.43 C9.2
  Bottom 0.152: v13.13,29.8 10.5,29.8 U1.29
N$25  (via drill 0.3)
  Top 0.152: v8.5,17.68 8.5,7.55 15.63,0.43 17.13,0.43 17.88,1.18 R5.2
  Bottom 0.152: v8.5,17.68 10.38,17.68 U1.5
N$26  (via drill 0.3)
  Top 0.152: v18.63,13.3 24.25,13.3 25.25,14.3 27.25,14.3 27.25,15.93 25.5,17.68 C12.2
  Bottom 0.152: v18.63,13.3 18.13,12.8 6.38,12.8 6.25,12.93 6.25,17.05 9.38,17.05 9.5,17.18 10.38,17.18 U1.4
N$27  (via drill 0.3)
  Top 0.152: v18.63,14.18 24.63,14.18 25.5,15.05 C13.2
  Bottom 0.152: v18.63,14.18 18.38,14.43 10.5,14.43 9.38,15.55 9.38,16.68 10.38,16.68 U1.3
N$28  (via drill 0.3)
  Top 0.152: v9.13,23.43 9.13,10.8 16.13,3.8 R11.1
  Bottom 0.152: 9.38,23.68 v9.13,23.43 | 9.38,23.68 10.38,23.68 U1.17 | 9.38,23.68 9.38,25.05 9.5,25.18 10.38,25.18 U1.20
N$29
  Top 0.152: R10.1 23.88,32.93 23.88,31.18 27.13,27.93 D1.ANODE 27.13,27.8 27.13,21.05 24.75,21.05 | 24.75,21.05 18,21.05 18,3.8 R11.2 | 24.75,21.05 25.5,20.3 C14.2
PTCP1
  Top 0.508: P1.P$1 52.53,5.58 52.35,5.41 51.46,5.41 51.19,5.13 51.19,4.24 VM_CN.1
PTCP2
  Top 1.016: P1.P$2 53.53,15.95 S1.A2 S1.A1
PWM0
  Top 0.152: IC1.23 39.63,22.55 39.88,22.8 40.13,22.8 40.38,23.05 40.38,27.05 34.38,27.05 R3.2
PWM1
  Top 0.152: R4.2 31.38,37.68 31.38,41.55 32.5,41.55 PWM0.I/O
SCL  (via drill 0.3)
  Top 0.152: v22.25,48.93 22.25,48.05 U$9.26 22.25,47.93 22.25,47.68 20.38,45.8 8.5,45.8 v8.5,22.93
  Bottom 0.152: v22.25,48.93 21.13,50.05 14.63,50.05 13.5,51.18 U$3.5 | v8.5,22.93 9.63,21.8 10.38,21.8 U1.13
SDA
  Top 0.152: U$9.27 21.63,48.05 21.63,50.05 12.13,50.05 11,51.18 U$3.3
  Bottom 0.152: U1.11 10.5,20.8 10.5,21.18 U1.12 10.38,21.3 9.25,21.3 6.25,24.3 6.25,52.43 9.75,52.43 10.88,51.3 U$3.3
VCC
  Top 0.305: C4.1 56.65,38.28 56.65,40.28 M1.1
  Top 1.016: C4.1 56.8,35.89 56.4,35.49 54.86,35.49 S1.K 51.32,31.79 51.32,30.41 38.62,30.41 37.74,31.29 C6.+ 37.74,43.99 37.35,44.38 37.11,44.14 PWM0.VCC

### Text on the board
tPlace: #609 | MOTOR | FaBo Gecko | VCC | Rev 1.1.0 | I/O | MADE IN JAPAN | GND | TX | RX | MOTOR / POWER | Debug-Serial